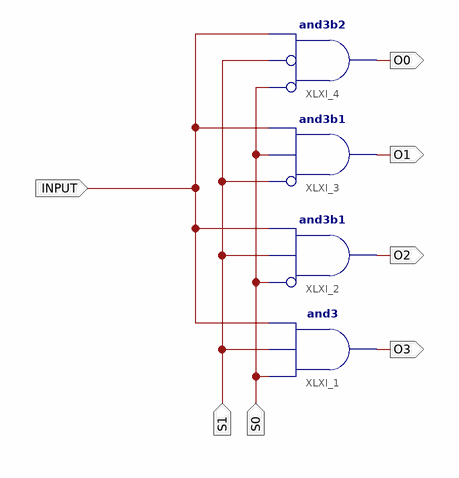
[diagram p0: schematic sheet 1]
// Xilinx ISE schematic Demux.sch (spartan3) as structural Verilog: 4 symbols, 7 ports
module Demux (
  input  INPUT,
  input  S0,
  input  S1,
  output O1,
  output O2,
  output O3,
  output O0
);

  and XLXI_1 (O3, S0, S1, INPUT);
  and XLXI_2 (O2, ~S0, S1, INPUT);  // and3b1
  and XLXI_3 (O1, ~S1, S0, INPUT);  // and3b1
  and XLXI_4 (O0, ~S0, ~S1, INPUT);  // and3b2
endmodule
